# Altium schematic sheet Power.SchDoc
size A; SheetNumber: 3; SheetTotal: 3
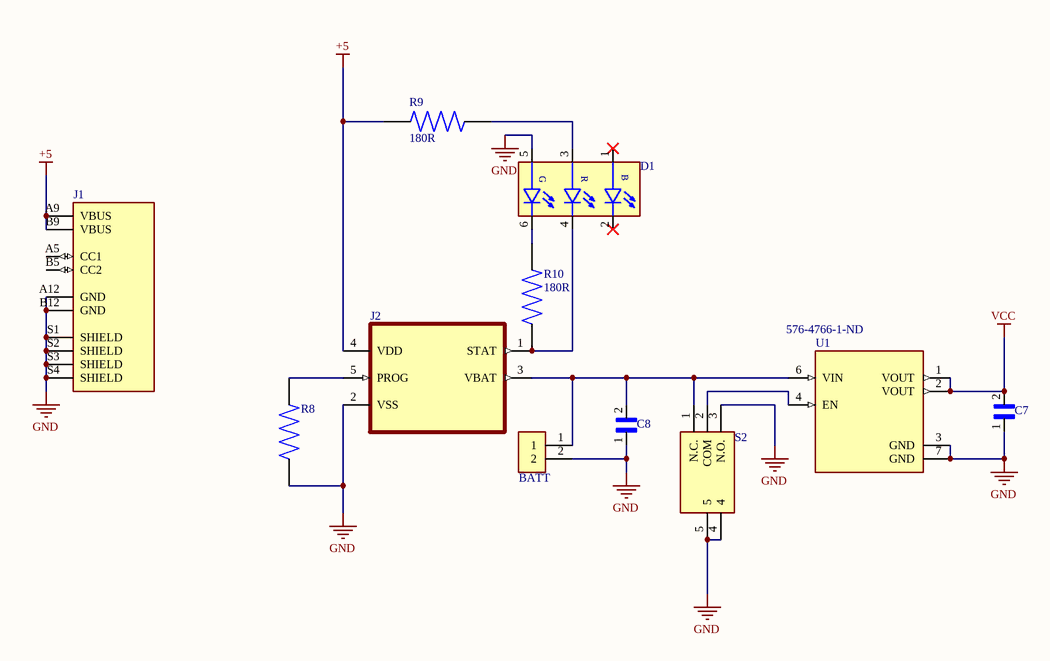
[diagram p0: Power.SchDoc]

## Parts
BATT  (no value)  [JST_B2B-PH-K-S(LF)(SN)]
C7  (no value)  [CAPC1608X90N]
C8  (no value)  [CAPC1608X90N]
D1  (no value)  [LED_QLS6B-FKW-CNSNSF043]
J1  (no value)  [GCT_USB4125-GF-A_REVA2]
J2  (no value)  [SOT95P280X145-5N]
R8  (no value)  [RESC1005X40]
R9  180R  [RESC1005X40]
R10  180R  [RESC1005X40]
S2  (no value)  [1101M2S3ABE2]
U1  Supplier Part Number 1: 576-4766-1-ND  [SON40P120X120X60-7N]

## Nets
+5: J1.A9(VBUS) J1.B9(VBUS) J2.4(VDD) R9.1
GND: BATT.2 C7.1 C8.1 D1.5(GREEN_ANODE) J1.A12(GND) J1.B12(GND) J1.S1(SHIELD) J1.S2(SHIELD) J1.S3(SHIELD) J1.S4(SHIELD) J2.2(VSS) R8.2 S2.3(N.O.) S2.4 S2.5 U1.3(GND) U1.7(GND)
VCC: C7.2 U1.1(VOUT) U1.2(VOUT)
NetBATT_1: BATT.1 C8.2 J2.3(VBAT) S2.1(N.C.) U1.6(VIN)
NetD1_3: D1.3(RED_ANODE) R9.2
NetD1_4: D1.4(RED_CATHODE) J2.1(STAT) R10.1
NetD1_6: D1.6(GREEN_CATHODE) R10.2
NetJ2_5: J2.5(PROG) R8.1
NetS2_2: S2.2(COM) U1.4(EN)

Not connected (* = marked no-connect by the designer): D1 1(BLUE_ANODE)* 2(BLUE_CATHODE)*; J1 A5(CC1) B5(CC2)

## Notes on the sheet
- (in symbol QLS6B-FKW-CNSNSF043) G; R; B

## Library data of the parts
BATT = B2B-PH-K-S(LF)(SN): Connector Header, PH Series, 2 Position, 2.00mm, Through Hole, Press-Fit, Solder, Natural; Manufacturer: JST; Manufacturer Part Number: B2BPHKSLFSN; Current Rating: 2A; Number of Positions: 2; Contact Resistance: 20mR; Insulation Resistance: 1MR; Gender: Male; Voltage Rating: 100V; Pitch: 2mm; Contact Post Length: 0.134inch; Mated Stacking Heights: 8mm; Supplier 1: Arrow Electronics; RoHS: Yes; Category: Connectors; Mount: Through Hole; Number of Pins: 2; Contact Material: Brass; Contact Plating: Tin,Copper; Color: Natural; Housing Color: White; Housing Material: Polyamide; Contact Shape: Square; Contact Finish - Mating: TIN; Insulation Material: Nylon; Insulation Color: Natural; Min Operating Temperature: -25°C; Max Operating Temperature: 85°C; Connector Type: Header; Termination: Press-Fit; Number of Rows: 1; Packaging: Bulk; Fastening Type: Detent; Number of Contacts: 2; Orientation: Straight; Series: PH; Contact Type: Male Pin; Max Current Rating: 2A; Number of Poles: 2; Voltage Rating (AC): 100V; Max Voltage Rating (AC): 100V; Working Voltage: 100V; Max Voltage Rating (DC): 100V; Length: 5.9mm; Width: 4.5mm; Height: 9.4mm; Contact Mating Length: 0.13inch; Lead Pitch: 2mm; Depth: 4.5mm; Insulation Height: 0.236inch; Lead Free: Lead Free; REACH SVHC: No SVHC; Flammability Rating: UL94 V-0; ComponentLink1URL: https://datasheet.ciiva.com/6747/80560-6747392.pdf?src-supplier=Newark; ComponentLink1Description: https://datasheet.ciiva.com/6747/80560-6747392.pdf?src-supplier=Newark; ComponentLink2URL: https://datasheet.ciiva.com/11746/0900766b8082f551-11746676.pdf?src-supplier=RSComponents; ComponentLink2Description: https://datasheet.ciiva.com/11746/0900766b8082f551-11746676.pdf?src-supplier=RSComponents; ComponentLink3URL: https://datasheet.ciiva.com/712/eph-712442.pdf?src-supplier=Digi-Key; ComponentLink3Description: https://datasheet.ciiva.com/712/eph-712442.pdf?src-supplier=Digi-Key; ComponentLink4URL: https://datasheet.ciiva.com/8052/80560-8052022.pdf?src-supplier=Element14; ComponentLink4Description: https://datasheet.ciiva.com/8052/80560-8052022.pdf?src-supplier=Element14; ComponentLink5URL: https://datasheet.ciiva.com/16422/b2b-ph-k-slfsn-16422715.pdf?src-supplier=Future+Electronics; ComponentLink5Description: https://datasheet.ciiva.com/16422/b2b-ph-k-slfsn-16422715.pdf?src-supplier=Future+Electronics
C7 C8 = CGA3E1X7R0J225K080AC: Cap Ceramic 2.2uF 6.3V X7R 10% SMD 0603 125C Paper T/R; Manufacturer: TDK; Supplier 1: Digi-Key; Manufacturer Part Number: CGA3E1X7R0J225K080AC; RoHS: Yes; Category: Ceramic Capacitors; Stock 1: 294875; Pricing 1: 1=0.24000, 10=0.16500, 50=0.09900, 100=0.08360, 500=0.05720, 1000=0.05060 (USD); Mount: Surface Mount; Case/Package: 0603; Case Code (Metric): 1608; Case Code (Imperial): 0603; Weight: 7.1E-05oz; Min Operating Temperature: -55°C; Max Operating Temperature: 125°C; Tolerance: 10%; Packaging: Tape and Reel; Capacitance: 2.2uF; Voltage Rating: 6.3V; Termination: SMD/SMT; Series: CGA; Voltage Rating (DC): 6.3V; Package Quantity: 1; Dielectric: X7R; Resistor Type: Ceramic; Length: 1.6mm; Width: 0.031inch; Height: 0.8mm; Thickness: 0.035inch; Depth: 0.8mm; Ratings: AEC-Q200; Lead Free: Lead Free; REACH SVHC: No SVHC; RoHS Compliant: Yes; ComponentLink1URL: https://datasheet.ciiva.com/24219/cga3e1x7r0j225k080ac-265889-24219571.pdf?src-supplier=Mouser; ComponentLink1Description: https://datasheet.ciiva.com/24219/cga3e1x7r0j225k080ac-265889-24219571.pdf?src-supplier=Mouser; ComponentLink2URL: https://datasheet.ciiva.com/28576/1796654-28576764.pdf?src-supplier=Element14; ComponentLink2Description: https://datasheet.ciiva.com/28576/1796654-28576764.pdf?src-supplier=Element14; ComponentLink3URL: https://datasheet.ciiva.com/22718/1796654-22718047.pdf?src-supplier=Element14; ComponentLink3Description: https://datasheet.ciiva.com/22718/1796654-22718047.pdf?src-supplier=Element14
D1 = QLS6B-FKW-CNSNSF043: CREE - QLS6B-FKW-CNSNSF043 - FULL RANK, TAPE&REEL 07AH1280; Color: Blue,Green,Red; Lens Style: Flat; Luminous Intensity: 1850mcd; Forward Voltage: 3.1V; Test Current: 16mA; Dominant Wavelength: 470nm; Lens Size: 3.95mm; Supplier 1: Avnet; Manufacturer: Cree; Manufacturer Part Number: QLS6B-FKW-CNSNSF043; RoHS: Yes; Category: LEDs; Stock 1: 3446; Pricing 1: 1=0.36000, 25=0.33800, 50=0.32500, 100=0.31200 (USD); Mount: Surface Mount; Case/Package: SMD/SMT; Packaging: Tape and Reel; Length: 4.45mm; Width: 1.3mm; Height: 1.3mm; RoHS Compliant: Yes; ComponentLink1URL: http://www.farnell.com/datasheets/2813763.pdf?src-supplier=Farnell; ComponentLink1Description: http://www.farnell.com/datasheets/2813763.pdf?src-supplier=Farnell; ComponentLink2URL: http://www.farnell.com/datasheets/2813763.pdf?src-supplier=Newark; ComponentLink2Description: http://www.farnell.com/datasheets/2813763.pdf?src-supplier=Newark; ComponentLink3URL: https://www.cree.com/led-components/media/documents/1397-QLS6BFKW.pdf?src-supplier=Digi-Key; ComponentLink3Description: https://www.cree.com/led-components/media/documents/1397-QLS6BFKW.pdf?src-supplier=Digi-Key
J1 = USB4125-GF-A_REVA2: USB Connector with 1.90mm shell stake length; Manufacturer: Global Connector Technology; Manufacturer Part Number: USB4125-GF-A-0190; Supplier 1: Newark; RoHS: No; Category: Uncategorized; Stock 1: 1979; Pricing 1: 1=0.59500, 50=0.52900, 100=0.49500, 250=0.46200, 500=0.41200, 1000=0.38300, 1500=0.35400, 3000=0.29800 (USD)
J2 = MCP73831T-2ACI/OT: MCP73831 Series Single-Cell Li-Ion/Li-Polymer Battery Charge Controller SOT-23-5; Manufacturer: Microchip; Number of Cells: 1; Output Voltage: 4.2V; Max Supply Voltage: 6V; Min Supply Voltage: 3.75V; Output Current: 500mA; Max Output Voltage: 4.5V; Min Output Voltage: 4.168V; Max Power Dissipation: 1.54W; Drain to Source Resistance: 350mR; Voltage Rating: 4.534V; Supplier 1: Digi-Key; Manufacturer Part Number: MCP73831T-2ACI/OT; RoHS: Yes; Category: Battery Management; Stock 1: 1281; Pricing 1: 1=0.69000, 25=0.63000 (USD); Mount: Surface Mount; Case/Package: SOT-23; Number of Pins: 5; Weight: 0.00709oz; Contact Plating: Tin,Matte; Min Operating Temperature: -40°C; Max Operating Temperature: 85°C; Packaging: Tape and Reel; Max Charge Current: 500mA; Max Input Voltage: 6V; Number of Outputs: 1; Number of Channels: 1; Termination: SMD/SMT; Series: MCP73831/2; Length: 0.122inch; Width: 0.071inch; Height: 0.051inch; Radiation Hardening: No; REACH SVHC: No SVHC; Lead Free: Lead Free; RoHS Compliant: Yes; ComponentLink1URL: https://datasheet.ciiva.com/22828/0900766b80d2b53a-22828876.pdf?src-supplier=RSComponents; ComponentLink1Description: https://datasheet.ciiva.com/22828/0900766b80d2b53a-22828876.pdf?src-supplier=RSComponents; ComponentLink2URL: https://datasheet.ciiva.com/26344/651521-da-01-en-contr-mcp73831t-2aci-ot-sot-23-5-mcp-26344458.pdf?src-supplier=Conrad; ComponentLink2Description: https://datasheet.ciiva.com/26344/651521-da-01-en-contr-mcp73831t-2aci-ot-sot-23-5-mcp-26344458.pdf?src-supplier=Conrad; ComponentLink3URL: https://datasheet.ciiva.com/1931/21984e-1931953.pdf?src-supplier=Digi-Key; ComponentLink3Description: https://datasheet.ciiva.com/1931/21984e-1931953.pdf?src-supplier=Digi-Key; ComponentLink4URL: https://datasheet.ciiva.com/1931/21984e-1931954.pdf?src-supplier=Digi-Key; ComponentLink4Description: https://datasheet.ciiva.com/1931/21984e-1931954.pdf?src-supplier=Digi-Key; ComponentLink5URL: https://datasheet.ciiva.com/1931/21984e-1931955.pdf?src-supplier=Digi-Key; ComponentLink5Description: https://datasheet.ciiva.com/1931/21984e-1931955.pdf?src-supplier=Digi-Key; ComponentLink6URL: https://datasheet.ciiva.com/28626/630369-28626439.pdf?src-supplier=Element14; ComponentLink6Description: https://datasheet.ciiva.com/28626/630369-28626439.pdf?src-supplier=Element14; ComponentLink7URL: https://datasheet.ciiva.com/1137/630369-1137803.pdf?src-supplier=Element14; ComponentLink7Description: https://datasheet.ciiva.com/1137/630369-1137803.pdf?src-supplier=Element14; ComponentLink8URL: https://datasheet.ciiva.com/3213/21984e-3213404.pdf?src-supplier=Avnet; ComponentLink8Description: https://datasheet.ciiva.com/3213/21984e-3213404.pdf?src-supplier=Avnet; ComponentLink9URL: https://datasheet.ciiva.com/46385/630369-46385324.pdf?src-supplier=Element14; ComponentLink9Description: https://datasheet.ciiva.com/46385/630369-46385324.pdf?src-supplier=Element14; ComponentLink10URL: https://datasheet.ciiva.com/1144/630369-1144461.pdf?src-supplier=Newark; ComponentLink10Description: https://datasheet.ciiva.com/1144/630369-1144461.pdf?src-supplier=Newark; ComponentLink11URL: https://datasheet.ciiva.com/16286/filehandler-aspxddocname-en025112-16286957.pdf?src-supplier=Future+Electronics; ComponentLink11Description: https://datasheet.ciiva.com/16286/filehandler-aspxddocname-en025112-16286957.pdf?src-supplier=Future+Electronics
R8 = RMCF0402JT10K0: RES 10K OHM 5% 1/16W 0402; Manufacturer: Stackpole Electronics; Resistance: 10kR; Power Rating: 62.5mW; Max Power Dissipation: 63mW; Temperature Coefficient: 100ppm/°C; Working Voltage: 50V; Supplier 1: Digi-Key; Manufacturer Part Number: RMCF0402JT10K0; RoHS: Yes; Category: Chip SMD Resistors; Stock 1: 2720859; Pricing 1: 1=0.10000, 10=0.01200, 100=0.00470, 1000=0.00213, 2500=0.00185, 5000=0.00153 (USD); Mount: Surface Mount; Case/Package: 0402; Case Code (Metric): 1005; Case Code (Imperial): 0402; Contact Plating: Tin,Matte; Min Operating Temperature: -55°C; Max Operating Temperature: 155°C; Packaging: Tape and Reel; Tolerance: 5%; Resistor Type: Thick Film; Number of Terminations: 2; Features: Automotive AEC-Q200; Series: RMCF; Technology: THICK FILM; Construction: Rectangular; Length: 1mm; Width: 0.02inch; Height: 0.016inch; Depth: 0.5mm; Radiation Hardening: No; Military Standard: Not; Lead Free: Lead Free; RoHS Compliant: Yes; ComponentLink1URL: https://datasheet.ciiva.com/15193/getdatasheetpartid-360689-15193431.pdf?src-supplier=Verical; ComponentLink1Description: https://datasheet.ciiva.com/15193/getdatasheetpartid-360689-15193431.pdf?src-supplier=Verical
R9 R10 = RMCF0402JT10K0_1: SMD Chip Resistor, 0402 [1005 Metric], 180 ohm, CRGCQ Series, 50 V, Thick Film, 63 mW; Manufacturer: TE Connectivity; Manufacturer Part Number: CRGCQ0402F180R; Tolerance: 1%; Max Power Dissipation: 63mW; Temperature Coefficient: 100ppm/°C; Supplier 1: Digi-Key; RoHS: Yes; Category: Chip SMD Resistors; Stock 1: 308550; Pricing 1: 1=0.10000, 10=0.02500, 100=0.01020, 1000=0.00457, 2500=0.00397, 5000=0.00328 (USD); Case/Package: 0402; Min Operating Temperature: -55°C; Max Operating Temperature: 155°C; Resistor Type: Thick Film; Features: Moisture Resistant,Automotive AEC-Q200; Packaging: Cut Tape; Resistance: 180R; Number of Terminations: 2; RoHS Compliant: Yes; ComponentLink1URL: http://www.farnell.com/datasheets/2609223.pdf?src-supplier=Farnell; ComponentLink1Description: http://www.farnell.com/datasheets/2609223.pdf?src-supplier=Farnell; ComponentLink2URL: http://www.te.com/commerce/DocumentDelivery/DDEController?Action=srchrtrv&DocNm=1773204-3&DocType=DS&DocLang=English&src-supplier=Digi-Key; ComponentLink2Description: http://www.te.com/commerce/DocumentDelivery/DDEController?Action=srchrtrv&DocNm=1773204-3&DocType=DS&DocLang=English&src-supplier=Digi-Key
S2 = 1101M2S3AQE2: Switch Slide ON None ON SPDT Side Slide 6A 250VAC 28VDC PC Pins Bracket Mount/Through Hole; Manufacturer: ITT C&K; Actuator Material: Nylon,Polyamide; Actuator Color: Black; Max Voltage Rating (AC): 250V; Max Voltage Rating (DC): 28V; Voltage Rating (AC): 120V; Electrical Life: 40000Cycles; Insulation Resistance: 1GR; Switch Travel: 2.16mm; Switch Function: On-On; Actuator Type: Standard; Actuator Length: 4.72mm; Approvals: UL; Supplier 1: Digi-Key; Manufacturer Part Number: 1101M2S3AQE2; RoHS: No; Category: Slide Switches; Stock 1: 9541; Pricing 1: 1=4.77000, 10=4.56700, 25=4.16960, 80=3.61375, 240=3.27617, 480=3.03790, 960=2.81948, 2400=2.56136 (USD); Mount: Through Hole,PCB,Brackets; Contact Material: Copper,Silver; Contact Plating: Silver; Housing Material: Stainless Steel; Min Operating Temperature: -30°C; Max Operating Temperature: 65°C; Throw Configuration: SPDT; Termination: PC Pins; Voltage Rating (DC): 28V; Max Current Rating: 6A; Package Quantity: 1; Packaging: Bulk; Contact Current Rating: 6A; Current Rating: 6A; Orientation: Horizontal; Series: 1000; Length: 13.57mm; Depth: 15.51mm; Radiation Hardening: No; REACH SVHC: No SVHC; Lead Free: Lead Free; Flammability Rating: UL94 V-0; ComponentLink1URL: https://datasheet.ciiva.com/16322/1101m2s3aqe2-16322026.pdf?src-supplier=Future+Electronics; ComponentLink1Description: https://datasheet.ciiva.com/16322/1101m2s3aqe2-16322026.pdf?src-supplier=Future+Electronics; ComponentLink2URL: https://datasheet.ciiva.com/8082/1000-30jul14-8082463.pdf?src-supplier=Avnet; ComponentLink2Description: https://datasheet.ciiva.com/8082/1000-30jul14-8082463.pdf?src-supplier=Avnet; ComponentLink3URL: https://datasheet.ciiva.com/16173/1000-30jul14-16173926.pdf?src-supplier=Onlinecomponents.com; ComponentLink3Description: https://datasheet.ciiva.com/16173/1000-30jul14-16173926.pdf?src-supplier=Onlinecomponents.com; ComponentLink4URL: https://datasheet.ciiva.com/1223/85795-1223385.pdf?src-supplier=Element14; ComponentLink4Description: https://datasheet.ciiva.com/1223/85795-1223385.pdf?src-supplier=Element14; ComponentLink5URL: https://datasheet.ciiva.com/1699/1000-30jul14-1699752.pdf?src-supplier=Newark; ComponentLink5Description: https://datasheet.ciiva.com/1699/1000-30jul14-1699752.pdf?src-supplier=Newark; ComponentLink6URL: https://datasheet.ciiva.com/2889/1000-30jul14-2889306.pdf?src-supplier=Digi-Key; ComponentLink6Description: https://datasheet.ciiva.com/2889/1000-30jul14-2889306.pdf?src-supplier=Digi-Key
U1 = MIC5528-3.3YMT-TR: LDO Regulator Pos 3.3V 0.5A 6-Pin TDFN EP T/R; Manufacturer: Microchip; Output Current: 500mA; Dropout Voltage: 260mV; Number of Regulators: 1; Min Current Limit: 525mA; Supplier 1: Digi-Key; Manufacturer Part Number: MIC5528-3.3YMT-TR; RoHS: No; Category: Voltage Regulators - Linear; Stock 1: 7816; Pricing 1: 1=0.23000, 25=0.20160, 100=0.18020 (USD); Mount: Surface Mount; Min Operating Temperature: -40°C; Max Operating Temperature: 125°C; Packaging: Tape and Reel; Output Voltage: 3.3V; ComponentLink1URL: http://www.microchip.com/mymicrochip/filehandler.aspx?ddocname=en580311&src-supplier=Digi-Key; ComponentLink1Description: http://www.microchip.com/mymicrochip/filehandler.aspx?ddocname=en580311&src-supplier=Digi-Key